# Altium schematic sheet Audio.SchDoc: Audio
size A3; DocumentNumber: MB1144; Revision: C-02; SheetNumber: 20; SheetTotal: 25; Project: STM32L476G-EVAL; ModifiedDate: 9/23/2015
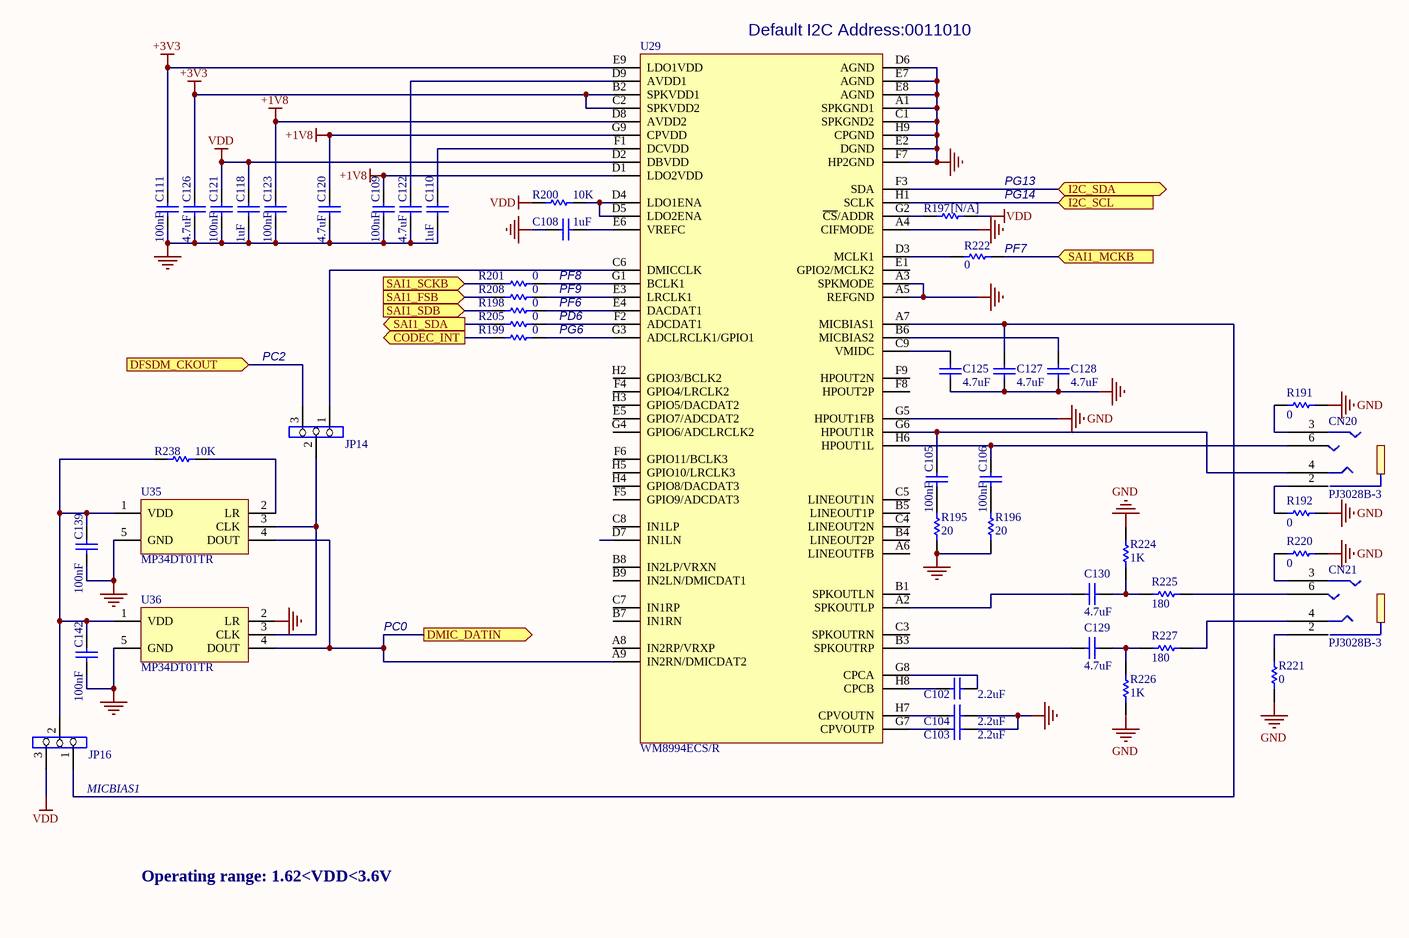
[diagram p0: Audio.SchDoc]

## Parts
C102  2.2uF  [0603C]
C103  2.2uF  [0603C]
C104  2.2uF  [0603C]
C105  100nF  [0402C]
C106  100nF  [0402C]
C108  1uF  [0603C]
C109  100nF  [0402C]
C110  1uF  [0603C]
C111  100nF  [0402C]
C118  1uF  [0603C]
C120  4.7uF  [0603C]
C121  100nF  [0402C]
C122  4.7uF  [0603C]
C123  100nF  [0402C]
C125  4.7uF  [0603C]
C126  4.7uF  [0603C]
C127  4.7uF  [0603C]
C128  4.7uF  [0603C]
C129  4.7uF  [0603C]
C130  4.7uF  [0603C]
C139  100nF  [0402C]
C142  100nF  [0402C]
CN20  PJ3028B-3  [PJ3028B]
CN21  PJ3028B-3  [PJ3028B]
JP14  Header 3X1  [SIP3]  (value not drawn)
JP16  Header 3X1  [SIP3]  (value not drawn)
R191  0  [0603R]
R192  0  [0603R]
R195  20  [0402R]
R196  20  [0402R]
R197  [N/A]  [0603R]
R198  0  [0603R]
R199  0  [0603R]
R200  10K  [0402R]
R201  0  [0603R]
R205  0  [0603R]
R208  0  [0603R]
R220  0  [0603R]
R221  0  [0603R]
R222  0  [0603R]
R224  1K  [0402R]
R225  180  [0402R]
R226  1K  [0402R]
R227  180  [0402R]
R238  10K  [0402R]
U29  WM8994ECS/R  [BGA72_0R5_4R5X4]
U35  MP34DT01TR  [MP34DT01TR]
U36  MP34DT01TR  [MP34DT01TR]

## Ports
CODEC_INT (out), DFSDM_CKOUT (in), DMIC_DATIN (out), I2C_SCL (in), I2C_SDA (bidir), SAI1_FSB (in), SAI1_MCKB (in), SAI1_SCKB (in), SAI1_SDA (out), SAI1_SDB (in)

## Nets
+1V8: C109.1 C120.1 C123.1 U29.D1(LDO2VDD) U29.D8(AVDD2) U29.G9(CPVDD)
+3V3: C111.1 C126.1 U29.B2(SPKVDD1) U29.C2(SPKVDD2) U29.E9(LDO1VDD)
GND: C103.2 C104.2 C108.2 C109.2 C110.2 C111.2 C118.2 C120.2 C121.2 C122.2 C123.2 C125.1 C126.2 C127.1 C128.1 C139.2 C142.2 R191.2 R192.1 R195.2 R196.2 R220.2 R221.2 R224.1 R226.1 U29.A1(SPKGND1) U29.A3(SPKMODE) U29.A4(CIFMODE) U29.A5(REFGND) U29.C1(SPKGND2) U29.D6(AGND) U29.E2(DGND) U29.E7(AGND) U29.E8(AGND) U29.F7(HP2GND) U29.G5(HPOUT1FB) U29.H9(CPGND) U35.5(GND) U36.2(LR) U36.5(GND)
VDD: C118.1 C121.1 JP16.3 R197.1 R200.2 U29.D2(DBVDD)
CODEC_INT: R199.2 ; port CODEC_INT
DFSDM_CKOUT: JP14.3 ; port DFSDM_CKOUT
DMIC_DATIN: U29.A9(IN2RN/DMICDAT2) U35.4(DOUT) U36.4(DOUT) ; port DMIC_DATIN
I2C_SCL: U29.H1(SCLK) ; port I2C_SCL
I2C_SDA: U29.F3(SDA) ; port I2C_SDA
SAI1_FSB: R208.2 ; port SAI1_FSB
SAI1_MCKB: R222.1 ; port SAI1_MCKB
SAI1_SCKB: R201.2 ; port SAI1_SCKB
SAI1_SDA: R205.2 ; port SAI1_SDA
SAI1_SDB: R198.2 ; port SAI1_SDB
NetC102_1: C102.1 U29.H8(CPCB)
NetC102_2: C102.2 U29.G8(CPCA)
NetC103_1: C103.1 U29.G7(CPVOUTP)
NetC104_1: C104.1 U29.H7(CPVOUTN)
NetC105_1: C105.1 CN20.4 U29.G6(HPOUT1R)
NetC105_2: C105.2 R195.1
NetC106_1: C106.1 CN20.6 U29.H6(HPOUT1L)
NetC106_2: C106.2 R196.1
NetC108_1: C108.1 U29.E6(VREFC)
NetC110_1: C110.1 U29.F1(DCVDD)
NetC122_1: C122.1 U29.D9(AVDD1)
NetC125_2: C125.2 U29.C9(VMIDC)
NetC127_2: C127.2 JP16.1 U29.A7(MICBIAS1)
NetC128_2: C128.2 U29.B6(MICBIAS2)
NetC129_1: C129.1 R226.2 R227.2
NetC129_2: C129.2 U29.B3(SPKOUTRP)
NetC130_1: C130.1 R224.2 R225.1
NetC130_2: C130.2 U29.A2(SPKOUTLP)
NetC139_1: C139.1 C142.1 JP16.2 R238.2 U35.1(VDD) U36.1(VDD)
NetCN20_2: CN20.2 R192.2
NetCN20_3: CN20.3 R191.1
NetCN21_2: CN21.2 R221.1
NetCN21_3: CN21.3 R220.1
NetCN21_4: CN21.4 R227.1
NetCN21_6: CN21.6 R225.2
NetJP14_1: JP14.1 U29.C6(DMICCLK)
NetJP14_2: JP14.2 U35.3(CLK) U36.3(CLK)
NetR197_2: R197.2 U29.G2(~{CS}/ADDR)
NetR198_1: R198.1 U29.E4(DACDAT1)
NetR199_1: R199.1 U29.G3(ADCLRCLK1/GPIO1)
NetR200_1: R200.1 U29.D4(LDO1ENA) U29.D5(LDO2ENA)
NetR201_1: R201.1 U29.G1(BCLK1)
NetR205_1: R205.1 U29.F2(ADCDAT1)
NetR208_1: R208.1 U29.E3(LRCLK1)
NetR222_2: R222.2 U29.D3(MCLK1)
NetR238_1: R238.1 U35.2(LR)

Not connected (* = marked no-connect by the designer): U29 A6(LINEOUTFB) A8(IN2RP/VRXP) B1(SPKOUTLN) B4(LINEOUT2P) B5(LINEOUT1P) B7(IN1RN) B8(IN2LP/VRXN) B9(IN2LN/DMICDAT1) C3(SPKOUTRN) C4(LINEOUT2N) C5(LINEOUT1N) C7(IN1RP) C8(IN1LP) D7(IN1LN) E1(GPIO2/MCLK2) E5(GPIO7/ADCDAT2) F4(GPIO4/LRCLK2) F5(GPIO9/ADCDAT3) F6(GPIO11/BCLK3) F8(HPOUT2P) F9(HPOUT2N) G4(GPIO6/ADCLRCLK2) H2(GPIO3/BCLK2) H3(GPIO5/DACDAT2) H4(GPIO8/DACDAT3) H5(GPIO10/LRCLK3)

## Notes on the sheet
- (near U29) Default I2C Address:0011010
- PG13
- PG14
- PF8
- PF9
- (near R222) PF7
- PC2
- PD6
- PF6
- PG6
- PC0
- (near JP16) MICBIAS1
- Operating range: 1.62<VDD<3.6V
- Title:
- Project:
- Size:
- Date:
- A3
- Reference:
- Sheet:
- Revision:
- of

## Library data of the parts
C102-C104 C108 C110 C118 = CAP: Capacitor; Value: 100nF; Ordered by: Subcon; ECCN_US/EU: NA; Published: 8-Jun-2000; Revision: July-2002: Re-released for DXP Platform.; Publisher: Altium Limited
C105 C106 C109 C111 C120-C123 C125-C130 C139 C142 = Cap: Capacitor; Value: 10nF; Ordered by: Subcon; ECCN_US/EU: NA; Published: 8-Jun-2000; Revision: July-2002: Re-released for DXP Platform.; Publisher: Altium Limited
CN20 CN21 = PJ3028B-3: ECCN_US/EU: NA; Ordered by: Subcon; Comments: Audio jack
JP14 JP16 = Jumper3: Ordered by: Subcon; ECCN_US/EU: NA
R191 R192 R195 R196 R198-R201 R205 R208 R220-R222 R225 R227 R238 = Res1: Resistor; Value: 1K; Ordered by: Subcon; ECCN_US/EU: NA; Published: 8-Jun-2000; Revision: July-2002: Re-released for DXP Platform.; Publisher: Altium Limited
R197 = Res1: Resistor; Value: 1K; Ordered by: Subcon; ECCN_US/EU: NA; Fitted: NO; Published: 8-Jun-2000; Revision: July-2002: Re-released for DXP Platform.; Publisher: Altium Limited
R224 R226 = Res1: Resistor; Ordered by: Subcon; ECCN_US/EU: NA; Published: 8-Jun-2000; Revision: July-2002: Re-released for DXP Platform.; Publisher: Altium Limited; Value: 1K
U29 = WM8994ECS/R: Manuf_1: Wolfson; Ordered by: Subcon; ECCN_US/EU: EAR99/NEC; Manuf_Part_1: WM8994ECS/R
U35 U36 = MP34DT01TR: MEMS audio sensor; Ordered by: ST; ECCN_US/EU: EAR99/NEC; Ref St: 9188008; Revision: 17-Jul-2002: Re-released for DXP Platform.; Publisher: Altium Limited; Manuf_1: ST; Manuf_Part_1: MP34DT01TR